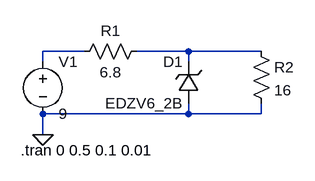
[diagram p0: schematic ej1_3.asc]
ej1_3.asc, the LTspice schematic file:
Version 4
SHEET 1 880 680
WIRE 32 -80 -32 -80
WIRE 192 -80 112 -80
WIRE 304 -80 192 -80
WIRE -32 -64 -32 -80
WIRE 192 -64 192 -80
WIRE 192 16 192 0
WIRE 192 16 -32 16
WIRE 304 16 304 0
WIRE 304 16 192 16
WIRE -32 48 -32 16
FLAG -32 48 0
SYMBOL res 128 -96 R90
WINDOW 0 0 56 VBottom 2
WINDOW 3 32 56 VTop 2
SYMATTR InstName R1
SYMATTR Value 6.8
SYMBOL zener 208 0 R180
WINDOW 0 24 64 Left 2
WINDOW 3 24 0 Left 2
SYMATTR InstName D1
SYMATTR Value EDZV6_2B
SYMATTR Description Diode
SYMATTR Type diode
SYMBOL res 288 -96 R0
SYMATTR InstName R2
SYMATTR Value 16
SYMBOL voltage -32 -80 R0
WINDOW 123 0 0 Left 2
WINDOW 39 0 0 Left 2
SYMATTR InstName V1
SYMATTR Value 9
TEXT -66 72 Left 2 !.tran 0 0.5 0.1 0.01

The netlist it stands for:
* ej1_3.asc
R1 N002 N001 6.8
D1 0 N002 EDZV6_2B
R2 N002 0 16
V1 N001 0 9
.model D D
.lib standard.dio
.tran 0 0.5 0.1 0.01
.backanno
.end